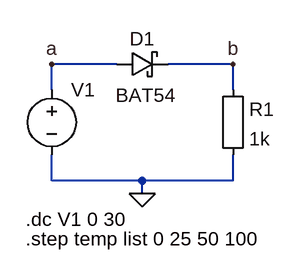
[diagram p0: schematic diode-va-forward.asc]
diode-va-forward.asc, the LTspice schematic file:
Version 4
SHEET 1 880 680
WIRE 16 208 -64 208
WIRE 160 208 80 208
WIRE -64 240 -64 208
WIRE 160 240 160 208
WIRE -64 352 -64 320
WIRE 48 352 -64 352
WIRE 160 352 160 320
WIRE 160 352 48 352
WIRE 48 368 48 352
FLAG -64 208 a
FLAG 160 208 b
FLAG 48 368 0
SYMBOL schottky 16 224 R270
WINDOW 0 32 32 VTop 2
WINDOW 3 -7 36 VBottom 2
SYMATTR InstName D1
SYMATTR Value BAT54
SYMATTR Description Diode
SYMATTR Type diode
SYMBOL Misc\\EuropeanResistor 144 224 R0
SYMATTR InstName R1
SYMATTR Value 1k
SYMBOL voltage -64 224 R0
SYMATTR InstName V1
SYMATTR Value ""
TEXT -96 400 Left 2 !.dc V1 0 30
TEXT -96 424 Left 2 !.step temp list 0 25 50 100

The netlist it stands for:
* diode-va-forward.asc
D1 a b BAT54
R1 b 0 1k
V1 a 0
.model D D
.lib standard.dio
.dc V1 0 30
.step temp list 0 25 50 100
.backanno
.end